# Altium schematic sheet Connectors.SchDoc
size A4
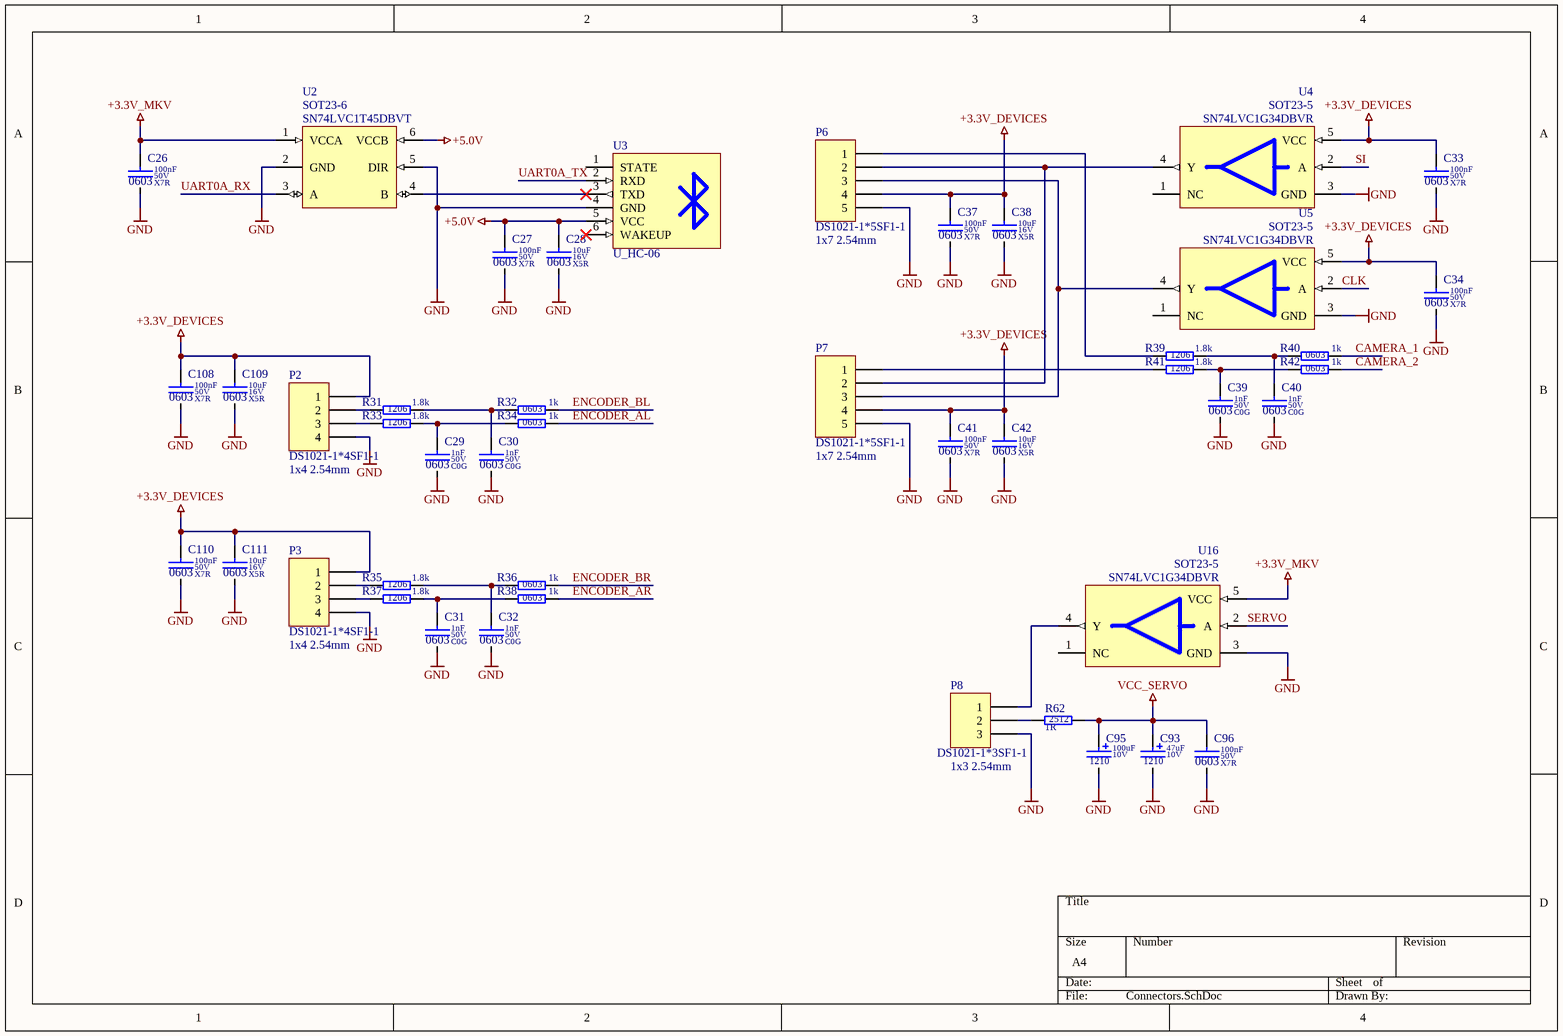
[diagram p0: Connectors.SchDoc]

## Parts
C26  value 100nF  Dielectric: X7R  Voltage: 50V  SCH_Footprint: 0603  [C_0603_1608]  (hidden comment: Ceramic X7R)
C27  value 100nF  Dielectric: X7R  Voltage: 50V  SCH_Footprint: 0603  [C_0603_1608]  (hidden comment: Ceramic X7R)
C28  value 10uF  Dielectric: X5R  Voltage: 16V  SCH_Footprint: 0603  [C_0603_1608]  (hidden comment: Ceramic X5R)
C29  value 1nF  Dielectric: C0G  Voltage: 50V  SCH_Footprint: 0603  [C_0603_1608]  (hidden comment: Ceramic C0G)
C30  value 1nF  Dielectric: C0G  Voltage: 50V  SCH_Footprint: 0603  [C_0603_1608]  (hidden comment: Ceramic C0G)
C31  value 1nF  Dielectric: C0G  Voltage: 50V  SCH_Footprint: 0603  [C_0603_1608]  (hidden comment: Ceramic C0G)
C32  value 1nF  Dielectric: C0G  Voltage: 50V  SCH_Footprint: 0603  [C_0603_1608]  (hidden comment: Ceramic C0G)
C33  value 100nF  Dielectric: X7R  Voltage: 50V  SCH_Footprint: 0603  [C_0603_1608]  (hidden comment: Ceramic X7R)
C34  value 100nF  Dielectric: X7R  Voltage: 50V  SCH_Footprint: 0603  [C_0603_1608]  (hidden comment: Ceramic X7R)
C37  value 100nF  Dielectric: X7R  Voltage: 50V  SCH_Footprint: 0603  [C_0603_1608]  (hidden comment: Ceramic X7R)
C38  value 10uF  Dielectric: X5R  Voltage: 16V  SCH_Footprint: 0603  [C_0603_1608]  (hidden comment: Ceramic X5R)
C39  value 1nF  Dielectric: C0G  Voltage: 50V  SCH_Footprint: 0603  [C_0603_1608]  (hidden comment: Ceramic C0G)
C40  value 1nF  Dielectric: C0G  Voltage: 50V  SCH_Footprint: 0603  [C_0603_1608]  (hidden comment: Ceramic C0G)
C41  value 100nF  Dielectric: X7R  Voltage: 50V  SCH_Footprint: 0603  [C_0603_1608]  (hidden comment: Ceramic X7R)
C42  value 10uF  Dielectric: X5R  Voltage: 16V  SCH_Footprint: 0603  [C_0603_1608]  (hidden comment: Ceramic X5R)
C93  value 47uF  SCH_Footprint: 1210  Voltage: 10V  [CT_1210_3225]  (hidden comment: Tantalum Capacitor)
C95  value 100uF  SCH_Footprint: 1210  Voltage: 10V  [CT_1210_3225]  (hidden comment: Tantalum Capacitor)
C96  value 100nF  Dielectric: X7R  Voltage: 50V  SCH_Footprint: 0603  [C_0603_1608]  (hidden comment: Ceramic X7R)
C108  value 100nF  Dielectric: X7R  Voltage: 50V  SCH_Footprint: 0603  [C_0603_1608]  (hidden comment: Ceramic X7R)
C109  value 10uF  Dielectric: X5R  Voltage: 16V  SCH_Footprint: 0603  [C_0603_1608]  (hidden comment: Ceramic X5R)
C110  value 100nF  Dielectric: X7R  Voltage: 50V  SCH_Footprint: 0603  [C_0603_1608]  (hidden comment: Ceramic X7R)
C111  value 10uF  Dielectric: X5R  Voltage: 16V  SCH_Footprint: 0603  [C_0603_1608]  (hidden comment: Ceramic X5R)
P2  value DS1021-1*4SF1-1  SCH_Footprint: 1x4 2.54mm  [P_HEADER_1x4_2.54]  (hidden comment: Goldpin)
P3  value DS1021-1*4SF1-1  SCH_Footprint: 1x4 2.54mm  [P_HEADER_1x4_2.54]  (hidden comment: Goldpin)
P6  value DS1021-1*5SF1-1  SCH_Footprint: 1x7 2.54mm  [P_HEADER_1x5_2.54]  (hidden comment: Goldpin)
P7  value DS1021-1*5SF1-1  SCH_Footprint: 1x7 2.54mm  [P_HEADER_1x5_2.54]  (hidden comment: Goldpin)
P8  value DS1021-1*3SF1-1  SCH_Footprint: 1x3 2.54mm  [P_HEADER_1x3_2.54]  (hidden comment: Goldpin)
R31  value 1.8k  SCH_Footprint: 1206  [R_1206_3216]  (hidden comment: Resistor)
R32  value 1k  SCH_Footprint: 0603  [R_0603_1608]  (hidden comment: Resistor)
R33  value 1.8k  SCH_Footprint: 1206  [R_1206_3216]  (hidden comment: Resistor)
R34  value 1k  SCH_Footprint: 0603  [R_0603_1608]  (hidden comment: Resistor)
R35  value 1.8k  SCH_Footprint: 1206  [R_1206_3216]  (hidden comment: Resistor)
R36  value 1k  SCH_Footprint: 0603  [R_0603_1608]  (hidden comment: Resistor)
R37  value 1.8k  SCH_Footprint: 1206  [R_1206_3216]  (hidden comment: Resistor)
R38  value 1k  SCH_Footprint: 0603  [R_0603_1608]  (hidden comment: Resistor)
R39  value 1.8k  SCH_Footprint: 1206  [R_1206_3216]  (hidden comment: Resistor)
R40  value 1k  SCH_Footprint: 0603  [R_0603_1608]  (hidden comment: Resistor)
R41  value 1.8k  SCH_Footprint: 1206  [R_1206_3216]  (hidden comment: Resistor)
R42  value 1k  SCH_Footprint: 0603  [R_0603_1608]  (hidden comment: Resistor)
R62  value 1R  SCH_Footprint: 2512  [R_2512_6432]  (hidden comment: Resistor)
U2  value SN74LVC1T45DBVT  SCH_Footprint: SOT23-6  [SOT23-6_SC74A_SOT753]  (hidden comment: Single-Bit Dual-Supply Bus Transceiver)
U3  U_HC-06  [BT_HC-06]
U4  value SN74LVC1G34DBVR  SCH_Footprint: SOT23-5  [SOT23-5_SC74A_SOT753_M]  (hidden comment: Single Buffer Gate)
U5  value SN74LVC1G34DBVR  SCH_Footprint: SOT23-5  [SOT23-5_SC74A_SOT753_M]  (hidden comment: Single Buffer Gate)
U16  value SN74LVC1G34DBVR  SCH_Footprint: SOT23-5  [SOT23-5_SC74A_SOT753_M]  (hidden comment: Single Buffer Gate)

## Nets
+3.3V_DEVICES: C33.1 C34.1 C37.1 C38.1 C41.1 C42.1 C108.1 C109.1 C110.1 C111.1 P2.1 P3.1 P6.4 P7.4 U4.5(VCC) U5.5(VCC)
+3.3V_MKV: C26.1 U2.1(VCCA) U16.5(VCC)
+5.0V: C27.1 C28.1 U2.6(VCCB) U3.5(VCC)
GND: C26.2 C27.2 C28.2 C29.2 C30.2 C31.2 C32.2 C33.2 C34.2 C37.2 C38.2 C39.2 C40.2 C41.2 C42.2 C93.2 C95.2 C96.2 C108.2 C109.2 C110.2 C111.2 P2.4 P3.4 P6.5 P7.5 P8.3 U2.2(GND) U2.5(DIR) U3.4(GND) U4.3(GND) U5.3(GND) U16.3(GND)
VCC_SERVO: C93.1 C95.1 C96.1 R62.2
CAMERA_1: R40.2
CAMERA_2: R42.2
CLK: U5.2(A)
ENCODER_AL: R34.2
ENCODER_AR: R38.2
ENCODER_BL: R32.2
ENCODER_BR: R36.2
SERVO: U16.2(A)
SI: U4.2(A)
UART0A_RX: U2.3(A)
UART0A_TX: U3.2(RXD)
NetC29_1: C29.1 R33.2 R34.1
NetC30_1: C30.1 R31.2 R32.1
NetC31_1: C31.1 R37.2 R38.1
NetC32_1: C32.1 R35.2 R36.1
NetC39_1: C39.1 R41.2 R42.1
NetC40_1: C40.1 R39.2 R40.1
NetP2_2: P2.2 R31.1
NetP2_3: P2.3 R33.1
NetP3_2: P3.2 R35.1
NetP3_3: P3.3 R37.1
NetP6_1: P6.1 R39.1
NetP6_2: P6.2 P7.2 U4.4(Y)
NetP6_3: P6.3 P7.3 U5.4(Y)
NetP7_1: P7.1 R41.1
NetP8_1: P8.1 U16.4(Y)
NetP8_2: P8.2 R62.1
NetU2_4: U2.4(B) U3.3(TXD)

Not connected (* = marked no-connect by the designer): U3 1(STATE) 6(WAKEUP)*; U4 1(NC); U5 1(NC); U16 1(NC)

## Library data of the parts
C26 C27 C33 C34 C37 C41 C96 C108 C110 = C_100nF_50V_X7R_0603_5: Capacitor; Manufacturer: Samsung; Manufacturer Part Number: CL10B104JB8NNNC; Tolerance (%): 5; Part Number: C_100nF_50V_X7R_0603_5; HelpURL: http://www.tme.eu/pl/Document/4a42202b32dab16128fe107dd69598cc/samsung-chip-cap.pdf; Supplier 1: TME; Supplier Part Number 1: CL10B104JB8NNNC; Supplier 2: RS Components; Supplier 3: Farnell; Supplier 4: Mouser; Supplier 5: Digi-Key
C28 C38 C42 C109 C111 = C_10uF_16V_X5R_0603_20: Capacitor; Manufacturer: Samsung Electro-Mechanics; Manufacturer Part Number: CL10A106MO8NQNC; Tolerance (%): 20; Part Number: C_10uF_16V_X5R_0603_20; HelpURL: http://www.tme.eu/pl/Document/4a42202b32dab16128fe107dd69598cc/samsung-chip-cap.pdf; Supplier 1: TME; Supplier Part Number 1: CL10A106MO8NQNC; Supplier 2: RS Components; Supplier 3: Farnell; Supplier 4: Mouser; Supplier 5: Digi-Key
C29-C32 C39 C40 = C_1nF_50V_C0G_0603_5: Capacitor; Manufacturer: Samsung; Manufacturer Part Number: CL10C102JB8NNNC; Tolerance (%): 5; Part Number: C_1nF_50V_C0G_0603_5; HelpURL: http://www.tme.eu/pl/Document/7da762c1dbaf553c64ad9c40d3603826/mlcc_samsung.pdf; Supplier 1: TME; Supplier Part Number 1: CL10C102JB8NNNC; Supplier 2: RS Components; Supplier 3: Farnell; Supplier 4: Mouser; Supplier 5: Digi-Key
C93 C95 = CT_100uF_10V_TA2O5_1210_20: Capacitor; Manufacturer: AVX; Manufacturer Part Number: TAJB107M010RNJ; Dielectric: TA2O5; Tolerance (%): 20; Part Number: CT_100uF_10V_TA2O5_1210_20; HelpURL: https://datasheet.octopart.com/TAJB107M010RNJ-AVX-datasheet-12511273.pdf; Supplier 1: TME; Supplier Part Number 1: TAJB107M010R; Supplier 2: RS Components; Supplier Part Number 2: 1360118; Supplier 3: Farnell; Supplier Part Number 3: 1658150; Supplier 4: Mouser; Supplier Part Number 4: 581-TAJB107M010R; Supplier 5: Digi-Key; Supplier Part Number 5: 478-5801-1-ND
P2 P3 = P_HEADER_1x4_2.54: Header, 4-Pin; Manufacturer: Connfly; Part Number: P_HEADER_1x4_2.54; Component Type: Standard; HelpURL: http://datasheet.octopart.com/DS1021-1%2A4SF1-1-Connfly-datasheet-65537859.pdf; Manufacturer Part Number: DS1021-1*4SF1-1; Supplier 1: TME; Supplier Part Number 1: ZL201-04G; Supplier 2: RS Components; Supplier 3: Farnell; Supplier 4: Mouser; Supplier 5: Digi-Key
P6 P7 = P_HEADER_1x5_2.54: Header, 5-Pin; Manufacturer: Connfly; Part Number: P_HEADER_1x5_2.54; Component Type: Standard; HelpURL: http://datasheet.octopart.com/DS1021-1%2A5SF1-1-Connfly-datasheet-65537859.pdf; Manufacturer Part Number: DS1021-1*5SF1-1; Supplier 1: TME; Supplier Part Number 1: ZL201-05G; Supplier 2: RS Components; Supplier 3: Farnell; Supplier 4: Mouser; Supplier 5: Digi-Key
P8 = P_HEADER_1x3_2.54: Header, 3-Pin; Manufacturer: Connfly; Part Number: P_HEADER_1x3_2.54; Component Type: Standard; HelpURL: http://www.tme.eu/en/Document/cc301e58a5da78cb543a94b5a5b7f06a/DS1021.pdf; Manufacturer Part Number: DS1021-1*3SF1-1; Supplier 1: TME; Supplier Part Number 1: ZL201-03G; Supplier 2: RS Components; Supplier 3: Farnell; Supplier 4: Mouser; Supplier 5: Digi-Key
R31 R33 R35 R37 R39 R41 = R_1.8k_1206_1: Manufacturer: Royalohm; Manufacturer Part Number: 1206S4F1801T5E; Voltage: 200V; Power: 250mW; Tolerance: 1%; Part Number: R_1.8k_1206_1; HelpURL: http://www.tme.eu/pl/Document/b315665a56acbc42df513c99b390ad98/ROYALOHM-THICKFILM.pdf; Supplier 1: TME; Supplier Part Number 1: SMD1206-1K8-1%; Supplier 2: RS Components; Supplier 3: Farnell; Supplier 4: Mouser; Supplier 5: Digi-Key
R32 R34 R36 R38 R40 R42 = R_1k_0603_1: Manufacturer: Vishay; Manufacturer Part Number: CRCW06031K00FKEA; Voltage: 75V; Power: 100mW; Tolerance: 1%; Part Number: R_1k_0603_1; HelpURL: http://www.farnell.com/datasheets/2310790.pdf?_ga=2.256888843.1690599162.1548417389-1379097396.1542296996&_gac=1.262631934.1547230258.Cj0KCQiAmuHhBRD0ARIsAFWyPwhX8HcvXnM3tA0ZBodZLzDIjH2ZxLpjT5LWo9bad_HPRbU8LfPq44UaAhEwEALw_wcB; Supplier 1: TME; Supplier 2: RS Components; Supplier Part Number 2: 678-9875P; Supplier 3: Farnell; Supplier Part Number 3: 1469740; Supplier 4: Mouser; Supplier Part Number 4: 71-CRCW0603-1.0K-E3; Supplier 5: Digi-Key; Supplier Part Number 5: 541-1.00KHCT-ND
R62 = R_1R_2512_1: Manufacturer: Vishay; Manufacturer Part Number: CRCW25121R00FKEG; Voltage: 500V; Power: 1W; Tolerance: 1%; Part Number: R_1R_2512_1; HelpURL: https://datasheet.octopart.com/CRCW25121R00FKEG-Vishay-datasheet-24897302.pdf; Supplier 1: TME; Supplier Part Number 1: CRCW25121R00FKEG; Supplier 2: RS Components; Supplier Part Number 2: 6792421; Supplier 3: Farnell; Supplier Part Number 3: 2112788; Supplier 4: Mouser; Supplier Part Number 4: 71-CRCW2512-1-E3; Supplier 5: Digi-Key; Supplier Part Number 5: 541-1.00AAFCT-ND
U2 = U_SN74LVC1T45DBVT: This single-bit noninverting bus transceiver uses two separate configurable power-supply rails.  VCCA and VCCB accepts any supply voltage from 1.65 V to 5.5 V. DIR low B->A, DIR high A->B; Manufacturer: Texas Instruments; Part Number: U_SN74LVC1T45DBVT; HelpURL: http://www.ti.com/lit/ds/symlink/sn74lvc1t45.pdf; Manufacturer Part Number: SN74LVC1T45DBVT; Supplier 1: TME; Supplier Part Number 1: SN74LVC1T45DBVT; Supplier 2: RS Components; Supplier Part Number 2: 6628825P; Supplier 3: Farnell; Supplier Part Number 3: 1470916; Supplier 4: Mouser; Supplier Part Number 4: 595-SN74LVC1T45DBVT; Supplier 5: Digi-Key; Supplier Part Number 5: 296-30381-1-ND
U4 U5 U16 = U_SN74LVC1G34_DBV_DCK_DRL: Manufacturer: Texas Instruments; Part Number: U_SN74LVC1G34_DBV_DCK_DRL; HelpURL: http://www.ti.com/lit/ds/symlink/sn74lvc1g34.pdf; Manufacturer Part Number: SN74LVC1G34DBVR; Supplier 1: TME; Supplier Part Number 1: SN74LVC1G34DBVR; Supplier 2: RS Components; Supplier Part Number 2: 662-8774; Supplier 3: Farnell; Supplier Part Number 3: 2134094; Supplier 4: Mouser; Supplier Part Number 4: 595-SN74LVC1G34DBVR; Supplier 5: Digi-Key; Supplier Part Number 5: 296-17893-1-ND